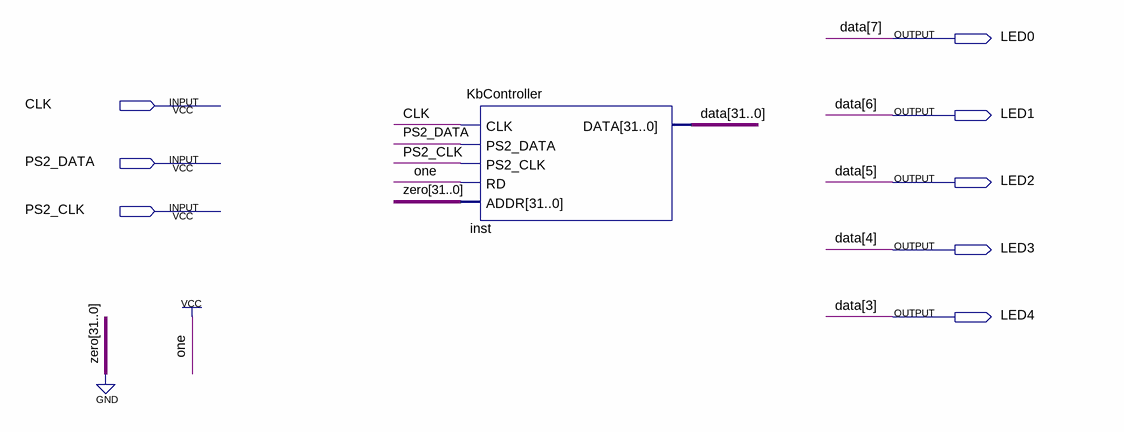
[diagram p0: schematic sheet]
// Quartus schematic TESTTT.bdf as structural Verilog: 1 symbols, 8 pins
module TESTTT (
  input  CLK,
  input  PS2_DATA,
  input  PS2_CLK,
  output LED0,
  output LED1,
  output LED2,
  output LED3,
  output LED4
);

  wire [31:0] data;

  KbController inst (
    .CLK(CLK), .PS2_DATA(PS2_DATA), .PS2_CLK(PS2_CLK), .RD(1'b1), .ADDR({32{1'b0}}),
    .DATA({data[31:8], LED0, LED1, LED2, LED3, LED4, data[2:0]}));

  // Other names for the same wires on the sheet: data[7:3] = {LED0, LED1, LED2, LED3, LED4}
endmodule
